# EAGLE schematic ATS (EAGLE 9.6.2)
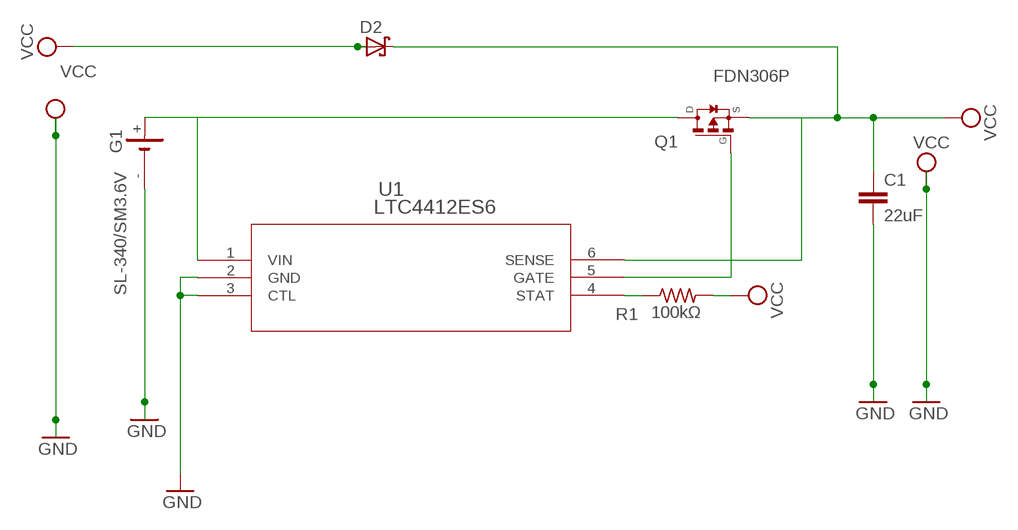
[diagram p0: schematic, sheet 1]

## Parts
C1  22uF  C2,5-3  [C2.5-3]
D2  SCHOTTKY-DIODEAG  [AG]
G1  SL-340/SM3.6V  [SL-340/SM3.6V]
Q1  FDN306P  [SSOT-3]
R1  100kΩ  R-US_0309/12  [0309/12]
U1  LTC4412ES6  [TSOT-23_S6]

## Nets
GND: C1.2 G1.- U1.2(GND) U1.3(CTL) ; supply symbol labelled VCC
N$1: R1.1 U1.4(STAT)
N$5: Q1.1(G) U1.5(GATE)
N$8: G1.+ Q1.3(D) U1.1(VIN)
VCC: C1.1 D2.A D2.C Q1.2(S) R1.2 U1.6(SENSE)
Unconnected: G1.-@1(-)

## Library data of the parts
C1 = capacitor-wima:C: CAPACITOR naming: grid - package width
D2 = adafruit:SCHOTTKY-DIODE: Schottky Diode
G1 = battery:SL-340/SM3.6V: LI BATTERY Sonnenschein
Q1 = FDN306P:FDN306P: P-Channel MOSFET 1.8V Specified PowerTrench Check availability <https://pricing.snapeda.com/parts/FDN306P./ON%20Semiconductor/view-part?ref=eda>; AVAILABILITY: Not in stock; DESCRIPTION: MOSFET, P CH, -12V, -2.6A, SUPERSOT; Transistor Polarity: P Channel; Continuous Drain Current Id: -2.6A; Drain Source Voltage Vds: -12V; On Resistance Rds(on): 0.03ohm; Rds(on) Test Voltage Vgs: -4.5V; Threshold Voltage Vgs: -600mV; Power Dissipation Pd: 500mW; Transistor Case Style: SuperSOT; No. of Pins: 3Pins; Operating Temperature Max: 150°C; Product Range: -; Automotive Qualification Standard: -; MSL: MSL 1 - Unlimited; SVHC: No SVHC (15-Jan-2018); Operating Temperature Min: -55°C; MF: ON Semiconductor; MP: FDN306P.; PACKAGE: None; PRICE: None
R1 = adafruit:R-US_: RESISTOR, American symbol
U1 = LTC4412ES6:LTC4412ES6: Check availability <https://pricing.snapeda.com/parts/LTC4412ES6/Analog%20Devices/view-part?ref=eda>; AVAILABILITY: In Stock; DESCRIPTION: OR Controller Source Selector Switch P-Channel 2:1 TSOT-23-6; MF: Analog Devices; MP: LTC4412ES6; PACKAGE: SOT-23-6 Linear Technology; PRICE: None